# Altium schematic sheet IO.SchDoc
size A3
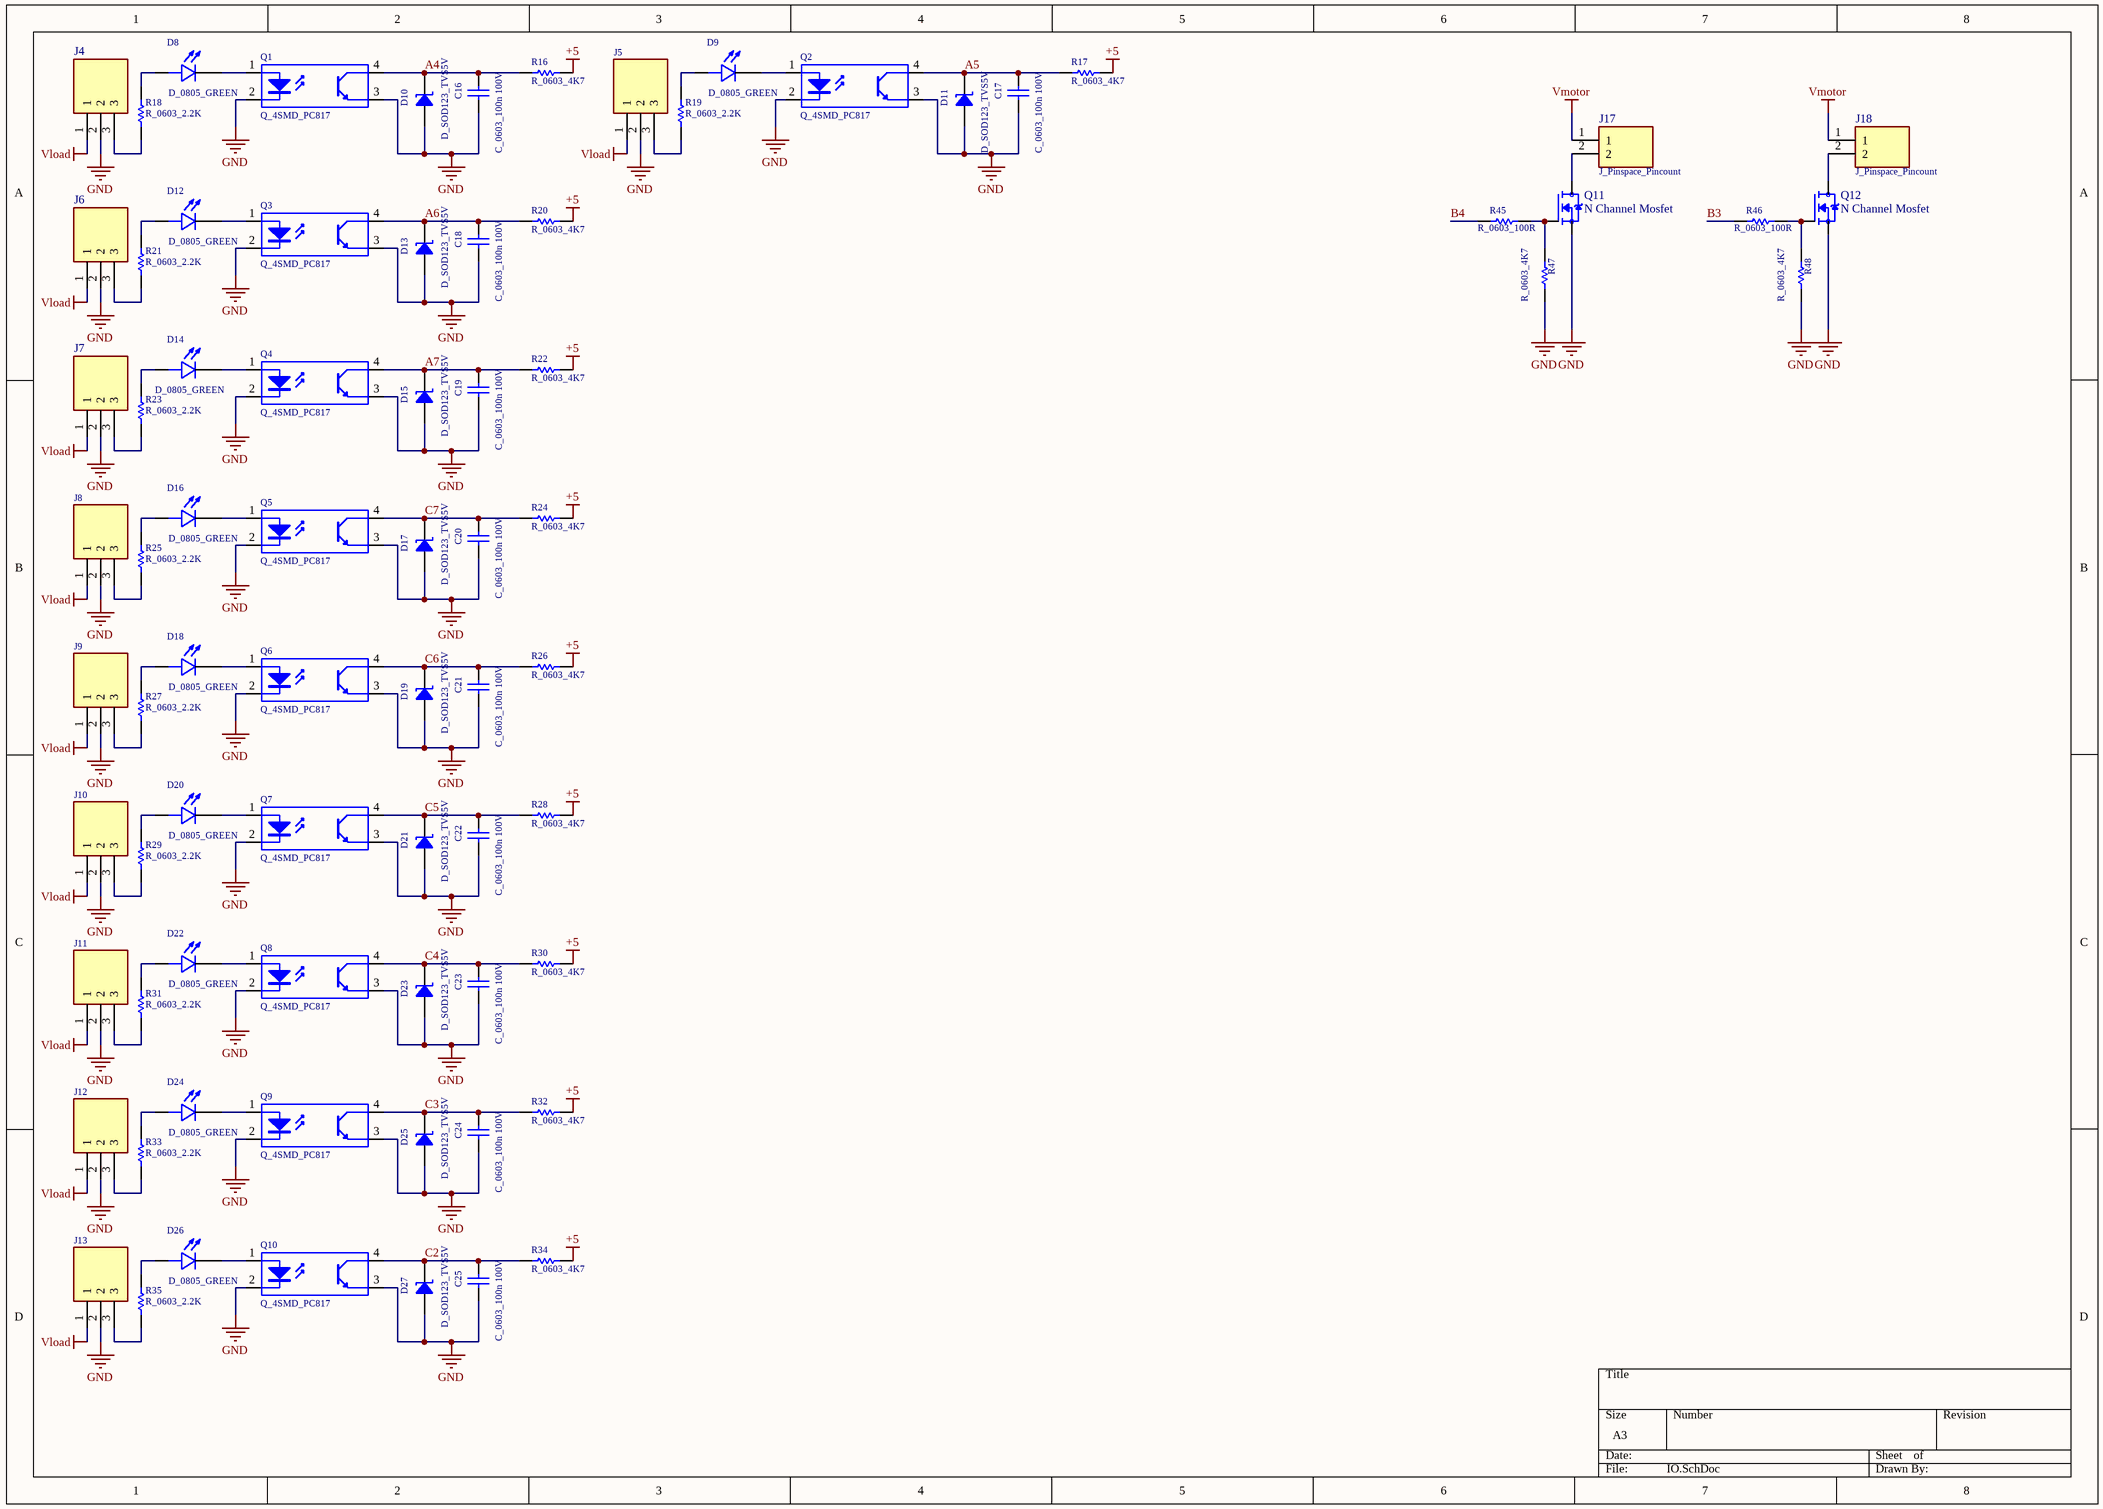
[diagram p0: IO.SchDoc]

## Parts
C16  C_0603_100n 100V  [CAP 1206]
C17  C_0603_100n 100V  [CAP 1206]
C18  C_0603_100n 100V  [CAP 1206]
C19  C_0603_100n 100V  [CAP 1206]
C20  C_0603_100n 100V  [CAP 1206]
C21  C_0603_100n 100V  [CAP 1206]
C22  C_0603_100n 100V  [CAP 1206]
C23  C_0603_100n 100V  [CAP 1206]
C24  C_0603_100n 100V  [CAP 1206]
C25  C_0603_100n 100V  [CAP 1206]
D8  D_0805_GREEN  [Led 0603]
D9  D_0805_GREEN  [Led 0603]
D10  D_SOD123_TVS5V  [SOD-123]
D11  D_SOD123_TVS5V  [SOD-123]
D12  D_0805_GREEN  [Led 0603]
D13  D_SOD123_TVS5V  [SOD-123]
D14  D_0805_GREEN  [Led 0603]
D15  D_SOD123_TVS5V  [SOD-123]
D16  D_0805_GREEN  [Led 0603]
D17  D_SOD123_TVS5V  [SOD-123]
D18  D_0805_GREEN  [Led 0603]
D19  D_SOD123_TVS5V  [SOD-123]
D20  D_0805_GREEN  [Led 0603]
D21  D_SOD123_TVS5V  [SOD-123]
D22  D_0805_GREEN  [Led 0603]
D23  D_SOD123_TVS5V  [SOD-123]
D24  D_0805_GREEN  [Led 0603]
D25  D_SOD123_TVS5V  [SOD-123]
D26  D_0805_GREEN  [Led 0603]
D27  D_SOD123_TVS5V  [SOD-123]
J4  J_Pinspace_Pincount  [3 Pin PCB STB 5.08]  (value not drawn)
J5  J_Pinspace_Pincount  [3 Pin PCB STB 5.08]  (value not drawn)
J6  J_Pinspace_Pincount  [3 Pin PCB STB 5.08]  (value not drawn)
J7  J_Pinspace_Pincount  [3 Pin PCB STB 5.08]  (value not drawn)
J8  J_Pinspace_Pincount  [3 Pin PCB STB 5.08]  (value not drawn)
J9  J_Pinspace_Pincount  [3 Pin PCB STB 5.08]  (value not drawn)
J10  J_Pinspace_Pincount  [3 Pin PCB STB 5.08]  (value not drawn)
J11  J_Pinspace_Pincount  [3 Pin PCB STB 5.08]  (value not drawn)
J12  J_Pinspace_Pincount  [3 Pin PCB STB 5.08]  (value not drawn)
J13  J_Pinspace_Pincount  [3 Pin PCB STB 5.08]  (value not drawn)
J17  J_Pinspace_Pincount  [2 Pin PCB STB 5.08]
J18  J_Pinspace_Pincount  [2 Pin PCB STB 5.08]
Q1  Q_4SMD_PC817  [4-SMD]
Q2  Q_4SMD_PC817  [4-SMD]
Q3  Q_4SMD_PC817  [4-SMD]
Q4  Q_4SMD_PC817  [4-SMD]
Q5  Q_4SMD_PC817  [4-SMD]
Q6  Q_4SMD_PC817  [4-SMD]
Q7  Q_4SMD_PC817  [4-SMD]
Q8  Q_4SMD_PC817  [4-SMD]
Q9  Q_4SMD_PC817  [4-SMD]
Q10  Q_4SMD_PC817  [4-SMD]
Q11  N Channel Mosfet  [TO-252]
Q12  N Channel Mosfet  [TO-252]
R16  R_0603_4K7  [RES 1206]
R17  R_0603_4K7  [RES 1206]
R18  R_0603_2.2K  [RES 1206]
R19  R_0603_2.2K  [RES 1206]
R20  R_0603_4K7  [RES 1206]
R21  R_0603_2.2K  [RES 1206]
R22  R_0603_4K7  [RES 1206]
R23  R_0603_2.2K  [RES 1206]
R24  R_0603_4K7  [RES 1206]
R25  R_0603_2.2K  [RES 1206]
R26  R_0603_4K7  [RES 1206]
R27  R_0603_2.2K  [RES 1206]
R28  R_0603_4K7  [RES 1206]
R29  R_0603_2.2K  [RES 1206]
R30  R_0603_4K7  [RES 1206]
R31  R_0603_2.2K  [RES 1206]
R32  R_0603_4K7  [RES 1206]
R33  R_0603_2.2K  [RES 1206]
R34  R_0603_4K7  [RES 1206]
R35  R_0603_2.2K  [RES 1206]
R45  R_0603_100R  [RES 1206]
R46  R_0603_100R  [RES 1206]
R47  R_0603_4K7  [RES 1206]
R48  R_0603_4K7  [RES 1206]

## Nets
+5: R16.1 R17.1 R20.1 R22.1 R24.1 R26.1 R28.1 R30.1 R32.1 R34.1
GND: C16.2 C17.2 C18.2 C19.2 C20.2 C21.2 C22.2 C23.2 C24.2 C25.2 D10.1 D11.1 D13.1 D15.1 D17.1 D19.1 D21.1 D23.1 D25.1 D27.1 J4.2 J5.2 J6.2 J7.2 J8.2 J9.2 J10.2 J11.2 J12.2 J13.2 Q1.2(K) Q1.3(E) Q2.2(K) Q2.3(E) Q3.2(K) Q3.3(E) Q4.2(K) Q4.3(E) Q5.2(K) Q5.3(E) Q6.2(K) Q6.3(E) Q7.2(K) Q7.3(E) Q8.2(K) Q8.3(E) Q9.2(K) Q9.3(E) Q10.2(K) Q10.3(E) Q11.3(S) Q12.3(S) R47.2 R48.2
Vload: J4.1 J5.1 J6.1 J7.1 J8.1 J9.1 J10.1 J11.1 J12.1 J13.1
Vmotor: J17.1 J18.1
A4: C16.1 D10.2 Q1.4(C) R16.2
A5: C17.1 D11.2 Q2.4(C) R17.2
A6: C18.1 D13.2 Q3.4(C) R20.2
A7: C19.1 D15.2 Q4.4(C) R22.2
B3: R46.2
B4: R45.2
C2: C25.1 D27.2 Q10.4(C) R34.2
C3: C24.1 D25.2 Q9.4(C) R32.2
C4: C23.1 D23.2 Q8.4(C) R30.2
C5: C22.1 D21.2 Q7.4(C) R28.2
C6: C21.1 D19.2 Q6.4(C) R26.2
C7: C20.1 D17.2 Q5.4(C) R24.2
NetD8_1: D8.1(A) R18.2
NetD8_2: D8.2(C) Q1.1(A)
NetD9_1: D9.1(A) R19.2
NetD9_2: D9.2(C) Q2.1(A)
NetD12_1: D12.1(A) R21.2
NetD12_2: D12.2(C) Q3.1(A)
NetD14_1: D14.1(A) R23.2
NetD14_2: D14.2(C) Q4.1(A)
NetD16_1: D16.1(A) R25.2
NetD16_2: D16.2(C) Q5.1(A)
NetD18_1: D18.1(A) R27.2
NetD18_2: D18.2(C) Q6.1(A)
NetD20_1: D20.1(A) R29.2
NetD20_2: D20.2(C) Q7.1(A)
NetD22_1: D22.1(A) R31.2
NetD22_2: D22.2(C) Q8.1(A)
NetD24_1: D24.1(A) R33.2
NetD24_2: D24.2(C) Q9.1(A)
NetD26_1: D26.1(A) R35.2
NetD26_2: D26.2(C) Q10.1(A)
NetJ4_3: J4.3 R18.1
NetJ5_3: J5.3 R19.1
NetJ6_3: J6.3 R21.1
NetJ7_3: J7.3 R23.1
NetJ8_3: J8.3 R25.1
NetJ9_3: J9.3 R27.1
NetJ10_3: J10.3 R29.1
NetJ11_3: J11.3 R31.1
NetJ12_3: J12.3 R33.1
NetJ13_3: J13.3 R35.1
NetJ17_2: J17.2 Q11.4(D)
NetJ18_2: J18.2 Q12.4(D)
NetQ11_1: Q11.1(G) R45.1 R47.1
NetQ12_1: Q12.1(G) R46.1 R48.1

## Library data of the parts
C16-C25 = Cap: Capacitor; Published: 8-Jun-2000; LatestRevisionDate: 17-Jul-2002; LatestRevisionNote: Re-released for DXP Platform.; Publisher: Altium Limited
D8 D9 D12 D14 D16 D18 D20 D22 D24 D26 = Led: MP: SML-D12FWT86; MF: Rohm; Price: None; Availability: In Stock; Package: 0603 Rohm; SnapEDA_Link: https://www.snapeda.com/parts/SML-D12FWT86/Rohm/view-part/?ref=snap; Check_prices: https://www.snapeda.com/parts/SML-D12FWT86/Rohm/view-part/?ref=eda; Value: *; Purchase-URL: https://pricing.snapeda.com/search/part/SML-D12FWT86/?ref=eda
D10 D11 D13 D15 D17 D19 D21 D23 D25 D27 = DIODE TVS UNI: Rectifier Diode
J4-J13 = 3 Pin PCB Terminal Block: MF: {'manufacturer': u'CUI'}; MP: TBP02R1-381-03BE; Price: None; Package: None; Value: *; Availability: Unavailable
J17 J18 = 2 Pin PCB Terminal Block: MF: CUI Devices; MP: TBP02R1-381-02BE; CUI_purchase_URL: https://www.cuidevices.com/product/interconnect/connectors/terminal-blocks/tbp02r1-381-series?utm_source=snapeda.com&utm_medium=referral&utm_campaign=snapedaBOM; Purchase-URL: https://pricing.snapeda.com/search/part/TBP02R1-381-02BE/?ref=eda; Price: None; SnapEDA_Link: https://www.snapeda.com/parts/TBP02R1-381-02BE/CUI+Devices/view-part/?ref=snap; Check_prices: https://www.snapeda.com/parts/TBP02R1-381-02BE/CUI+Devices/view-part/?ref=eda; Package: None; Availability: In Stock; Value: *
Q1-Q10 = Opto Coupler: Opto-Coupler
Q11 Q12 = N Channel Mosfet: RoHS Compliant | Low RDS(on) | Industry-leading quality | Dynamic dv/dt Rating | Fast Switching | Fully Avalanche Rated | 175C Operating Temperature | Logic Level; MP: IRLR2705PBF; MF: Infineon Technologies; Check_prices: https://www.snapeda.com/parts/IRLR2705PBF/Infineon+Technologies/view-part/?ref=eda; Value: *; Availability: In Stock; Price: None; Package: TO-252 Infineon; SnapEDA_Link: https://www.snapeda.com/parts/IRLR2705PBF/Infineon+Technologies/view-part/?ref=snap; Purchase-URL: https://pricing.snapeda.com/search/part/IRLR2705PBF/?ref=eda
R16-R35 R45-R48 = Res: Resistor; Published: 8-Jun-2000; LatestRevisionDate: 17-Jul-2002; LatestRevisionNote: Re-released for DXP Platform.; Publisher: Altium Limited